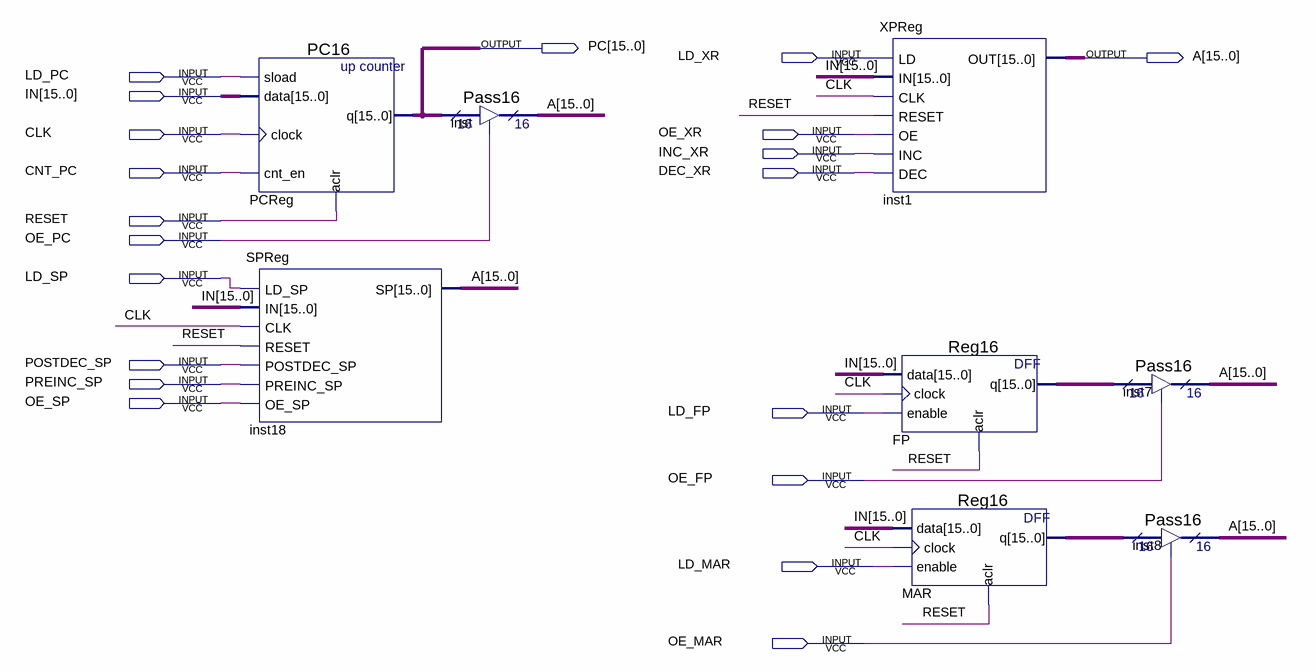
[diagram p0: schematic sheet]
// Quartus schematic AddressRegs.bdf as structural Verilog: 8 symbols, 20 pins
module AddressRegs (
  input  LD_XR,
  input  LD_PC,
  input  [15:0] IN,
  input  CLK,
  input  OE_XR,
  input  INC_XR,
  input  CNT_PC,
  input  DEC_XR,
  input  RESET,
  input  OE_PC,
  input  LD_SP,
  input  POSTDEC_SP,
  input  PREINC_SP,
  input  OE_SP,
  input  LD_FP,
  input  OE_FP,
  input  LD_MAR,
  input  OE_MAR,
  output [15:0] PC,
  output [15:0] A
);

  wire [15:0] FP_q, MAR_q;

  PC16 PCReg (.sload(LD_PC), .data(IN), .clock(CLK), .cnt_en(CNT_PC), .aclr(RESET), .q(PC));
  SPReg inst18 (
    .LD_SP(LD_SP), .IN(IN), .CLK(CLK), .RESET(RESET), .POSTDEC_SP(POSTDEC_SP), .PREINC_SP(PREINC_SP),
    .OE_SP(OE_SP), .SP(A));
  Pass16 inst (.enabledt(OE_PC), .data(PC), .tridata(A));
  XPReg inst1 (.LD(LD_XR), .IN(IN), .CLK(CLK), .RESET(RESET), .OE(OE_XR), .INC(INC_XR), .DEC(DEC_XR), .OUT(A));
  Reg16 FP (.data(IN), .clock(CLK), .enable(LD_FP), .aclr(RESET), .q(FP_q));
  Reg16 MAR (.data(IN), .clock(CLK), .enable(LD_MAR), .aclr(RESET), .q(MAR_q));
  Pass16 inst7 (.enabledt(OE_FP), .data(FP_q), .tridata(A));
  Pass16 inst8 (.enabledt(OE_MAR), .data(MAR_q), .tridata(A));
endmodule
